# Altium schematic sheet CAN.SchDoc: CAN
size 279 x 215 mm; CheckedBy: Lance Bantoto; Engineer: Cindy Li; DocumentNumber: 21; Revision: 1; SheetNumber: 21; SheetTotal: 23
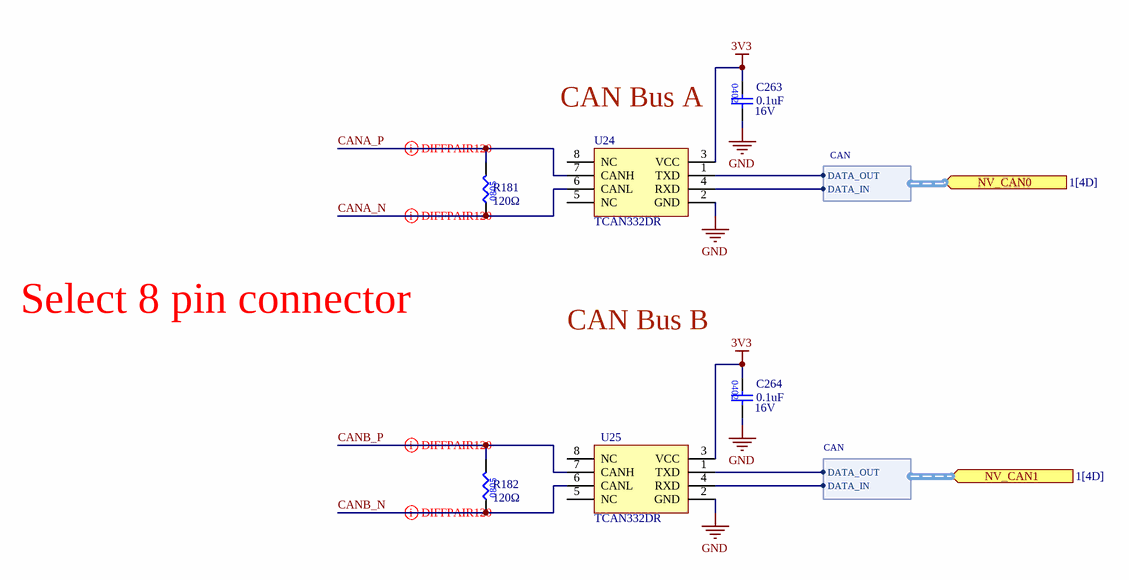
[diagram p0: CAN.SchDoc]

## Parts
C263  Capacitance: 0.1uF  Voltage Rating: 16V  [CAP0402]  (hidden comment: CAP_0.1uF_16V_X7R_0402)
C264  Capacitance: 0.1uF  Voltage Rating: 16V  [CAP0402]  (hidden comment: CAP_0.1uF_16V_X7R_0402)
R181  value 120Ω  [RES0805]  (hidden comment: RES_120Ω_0805_1%)
R182  value 120Ω  [RES0805]  (hidden comment: RES_120Ω_0805_1%)
U24  TCAN332DR  [SOIC127P599X175-8N]
U25  TCAN332DR  [SOIC127P599X175-8N]

## Ports
NV_CAN0 (in, harness CAN, see 1[4D]), NV_CAN1 (in, harness CAN, see 1[4D])

## Harnesses
CAN: DATA_OUT, DATA_IN

## Nets
3V3: C263.1 C264.1 U24.3(VCC) U25.3(VCC)
GND: C263.2 C264.2 U24.2(GND) U25.2(GND)
CANA_N: R181.1 U24.6(CANL)
CANA_P: R181.2 U24.7(CANH)
CANB_N: R182.1 U25.6(CANL)
CANB_P: R182.2 U25.7(CANH)
NetU24_1: U24.1(TXD) ; port NV_CAN0.DATA_OUT
NetU24_4: U24.4(RXD) ; port NV_CAN0.DATA_IN
NetU25_1: U25.1(TXD) ; port NV_CAN1.DATA_OUT
NetU25_4: U25.4(RXD) ; port NV_CAN1.DATA_IN

Not connected (* = marked no-connect by the designer): U24 5(NC) 8(NC); U25 5(NC) 8(NC)

## Layout directives
differential pair: CANA_N, CANA_P, CANB_N, CANB_P

## Notes on the sheet
- CAN Bus A
- Select 8 pin connector
- CAN Bus B
- University of Waterloo Robotics Team
- 200 University Ave W
- REV
- PROJECT
- Waterloo, Ontario, Canada
- N2L 3G1
- DOCUMENT
- ENGINEER
- REVIEWER
- MODIFIED
- SHEET
- OF

## Library data of the parts
C263 C264 = CAP_0.1uF_16V_X7R_0402: CAP CER 0.1UF 16V X7R 0402; Supplier 1: Digi-Key; Mounting Type: Surface Mount; Package: 0402
R181 R182 = RES_120Ω_0805_1%: RES 120 OHM 1% 1/8W 0805; Manufacturer 1: Vishay; Manufacturer Part Number 1: CRCW0805120RFKEA; Package/Footprint: 0805; Supplier Part Number 1: 541-120CCT-ND; Supplier 1: Digi-Key; LCSC Part #: C17437; Mounting Type: SMD
U24 U25 = TCAN332DR: IC CAN TRANSCEIVER; Manufacturer 1: Texas Instruments; Manufacturer Part Number 1: TCAN332DR; Supplier Part Number 1: 296-43711-1-ND; Supplier 1: Digi-Key